# EAGLE design untitled (EAGLE 9.5.2)
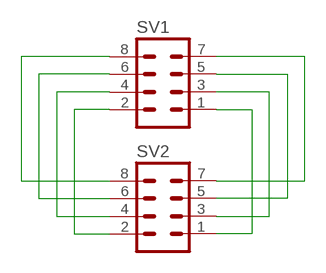
[diagram p0: schematic, sheet 1]

## Parts
SV1  MA04-2  [MA04-2]
SV2  MA04-2  [MA04-2]

## Nets
N$1: SV1.1 SV2.1
N$2: SV1.3 SV2.3
N$3: SV1.5 SV2.5
N$4: SV1.7 SV2.7
N$5: SV1.8 SV2.8
N$6: SV1.6 SV2.6
N$7: SV1.4 SV2.4
N$8: SV1.2 SV2.2

## Library data of the parts
SV1 SV2 = con-lstb:MA04-2: PIN HEADER; OC_FARNELL: unknown; OC_NEWARK: unknown

## Board
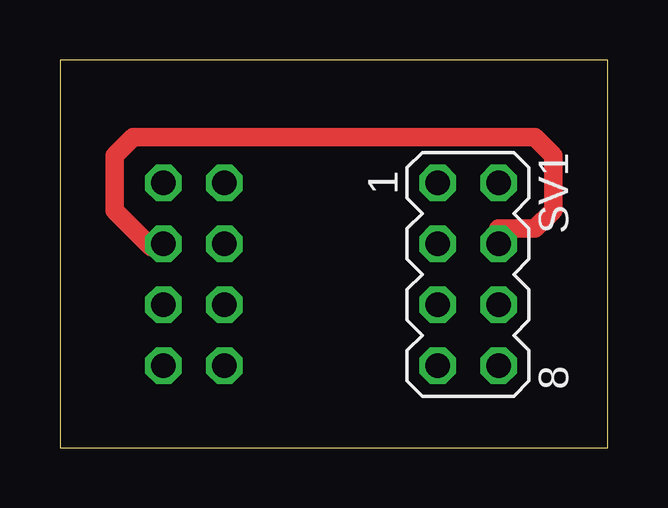
[diagram p1: board, top side]
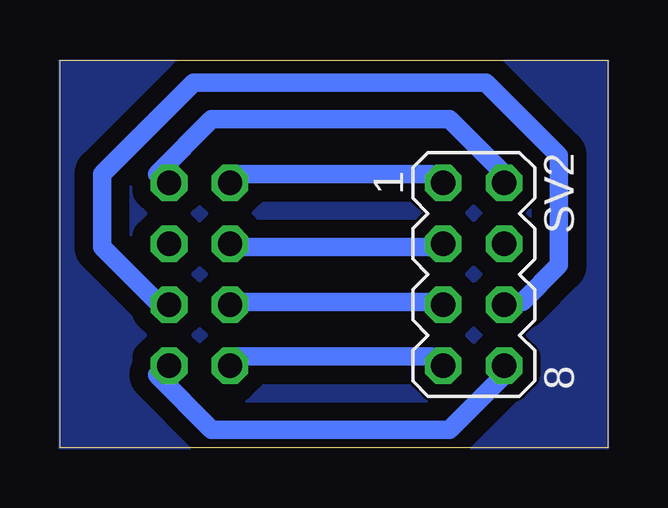
[diagram p2: board, bottom side, seen from below]

Size 22.84 x 16.18 mm. Coordinates in mm from the lower left corner, seen from the top.
Outline: 0,0 22.84,0 22.84,16.18 0,16.18 0,0
Copper layers (1*16): Top 0.035mm / dielectric 1.5mm / Bottom 0.035mm
Design rules "default": minimum track width 30mil, minimum drill 0.9mm, track to track 30mil, track to pad 30mil, pad to pad 20mil, via to via 10mil, smd to smd 6mil, copper to edge 0mil, drill to drill 6mil, minimum pad ring 10mil, minimum via ring 15mil, stop-mask expansion 4mil, vias tented up to drill 0mil, thermal gap 20mil

### Footprints (pad centres in the part's own frame; a part is rotated, then mirrored left to right if it is on the bottom)
MA04-2 = drill 1.016 octagon: 1 -3.81,-1.27; 2 -3.81,1.27; 3 -1.27,-1.27; 4 -1.27,1.27; 5 1.27,-1.27; 6 1.27,1.27; 7 3.81,-1.27; 8 3.81,1.27

### Placement (x,y rotation side)
SV1  17.02,7.24 270 top
SV2  5.59,7.24 270 bottom

### Tracks (layer width: path | path; a pad name or v marks a point on that pad's centre or on a via)
GND
  pour Bottom: 0,0 22.86,0 22.86,16.13 0,16.13
N$1
  Bottom 0.762: SV2.1 7.37,11.43 15.75,11.43 SV1.1
N$2
  Bottom 0.762: SV2.3 7.37,8.38 15.75,8.38 SV1.3
N$3
  Bottom 0.762: SV2.5 7.37,6.1 15.75,6.1 SV1.5
N$4
  Bottom 0.762: SV2.7 7.37,3.81 15.75,3.81 SV1.7
N$5
  Bottom 0.762: SV2.8 4.32,3.05 6.6,0.76 16.51,0.76 18.8,3.05 SV1.8
N$6
  Bottom 0.762: SV2.6 4.32,6.1 3.56,6.1 2.03,7.62 2.03,12.19 5.08,15.24 17.27,15.24 21.08,11.43 21.08,8.38 18.8,6.1 SV1.6
N$7
  Top 0.762: SV2.4 3.81,8.38 2.29,9.91 2.29,12.19 3.05,12.95 19.81,12.95 20.57,12.19 20.57,9.91 19.81,9.14 18.29,9.14 SV1.4
N$8
  Bottom 0.762: SV2.2 4.32,11.43 6.6,13.72 16.51,13.72 18.8,11.43 SV1.2